# EAGLE schematic buck_breakout (EAGLE 6.5.0)
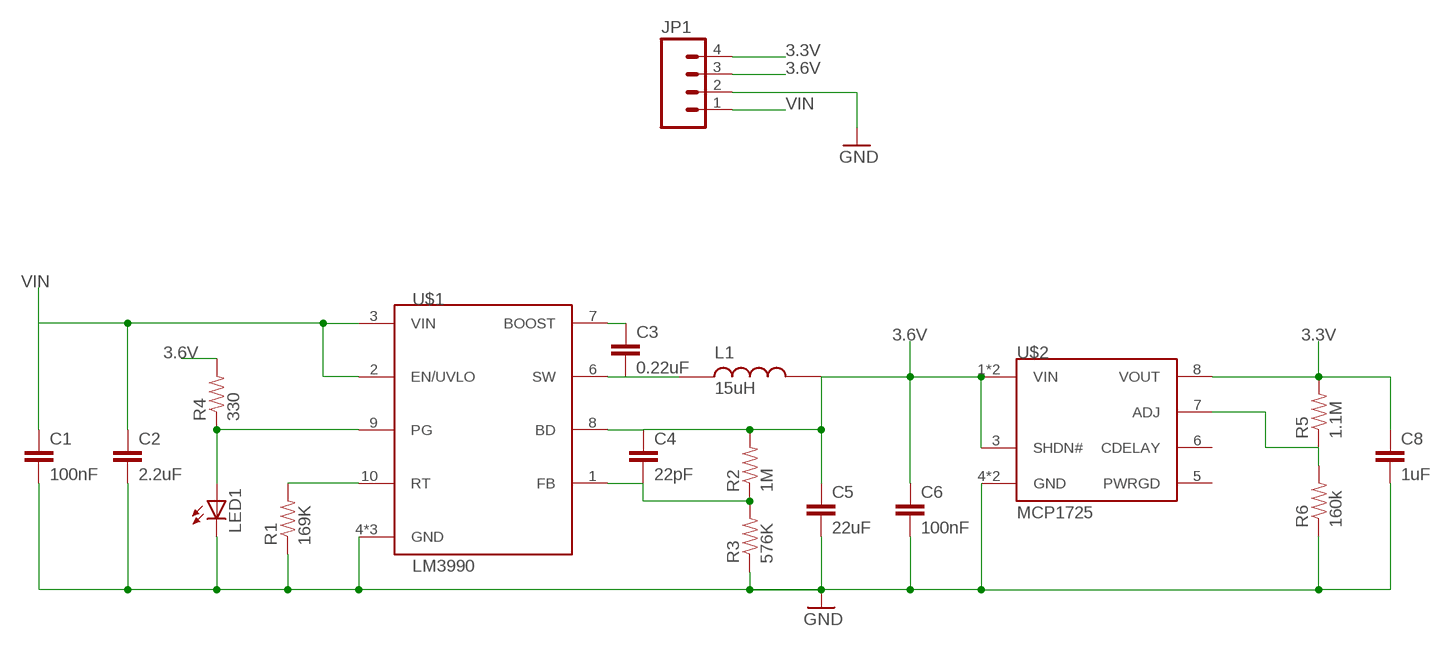
[diagram p0: schematic, sheet 1]

## Parts
C1  100nF  CAP0603-CAP  [0603-CAP]
C2  2.2uF  CAP1206  [1206]
C3  0.22uF  CAP0603-CAP  [0603-CAP]
C4  22pF  CAP0603-CAP  [0603-CAP]
C5  22uF  CAP1206  [1206]
C6  100nF  CAP0603-CAP  [0603-CAP]
C8  1uF  CAP0603-CAP  [0603-CAP]
JP1  M04PTH  [1X04]
L1  15uH  NR6028T150M  [NR6028T150M]
LED1  LED0603  [LED-0603]
R1  169K  RESISTOR0402-S  [0402-S]
R2  1M  RESISTOR0402-S  [0402-S]
R3  576K  RESISTOR0402-S  [0402-S]
R4  330  RESISTOR0402-S  [0402-S]
R5  1.1M  RESISTOR0402-S  [0402-S]
R6  160k  RESISTOR0402-S  [0402-S]
U$1  LM3990  [DD10]
U$2  MCP1725  [2X3_DFN]

## Nets
3.3V: C8.1 JP1.4 R5.2 U$2.8(VOUT)
3.6V: C4.1 C5.1 C6.1 JP1.3 L1.2 R2.2 R4.2 U$1.8(BD) U$2.1(VIN) U$2.2(VIN) U$2.3(SHDN#)
FB: C4.2 R2.1 R3.2 U$1.1(FB)
GND: C1.2 C2.2 C5.2 C6.2 C8.2 JP1.2 LED1.C R1.1 R3.1 R6.1 U$1.4(GND) U$1.5(GND) U$1.EP\(GND) U$2.4(GND) U$2.EP(GND)
N$2: LED1.A R4.1 U$1.9(PG)
N$4: C3.1 U$1.7(BOOST)
N$6: R5.1 R6.2 U$2.7(ADJ)
N$7: R1.2 U$1.10(RT)
SW: C3.2 L1.1 U$1.6(SW)
VIN: C1.1 C2.1 JP1.1 U$1.2(EN/UVLO) U$1.3(VIN)
Unconnected: U$2.5(PWRGD) U$2.6(CDELAY)

## Library data of the parts
C1-C6 C8 = chips:CAP: Capacitor Standard 0603 ceramic capacitor, and 0.1" leaded capacitor.
JP1 = SparkFun-Connectors:M04: Header 4 Standard 4-pin 0.1" header. Use with straight break away headers (SKU : PRT-00116), right angle break away headers (PRT-00553), swiss pins (PRT-00743), machine pins (PRT-00117), and female headers (PRT-00115). Molex polarized connector foot print use with SKU : PRT-08231 with associated crimp pins and housings. 1MM SMD Version SKU: PRT-10208
L1 = brent:NR6028T150M
LED1 = chips:LED: LEDs Standard schematic elements and footprints for 5mm, 3mm, 1206, and 0603 sized LEDs. 5mm - Spark Fun Electronics SKU : COM-00529 (and others)
R1-R6 = chips:RESISTOR: Resistor Basic schematic elements and footprints for 0603, 1206, and PTH resistors.
U$1 = brent:LM3990
U$2 = intelliDesk:MCP1725